# EAGLE design Buck_eFuse (EAGLE 9.5.1)
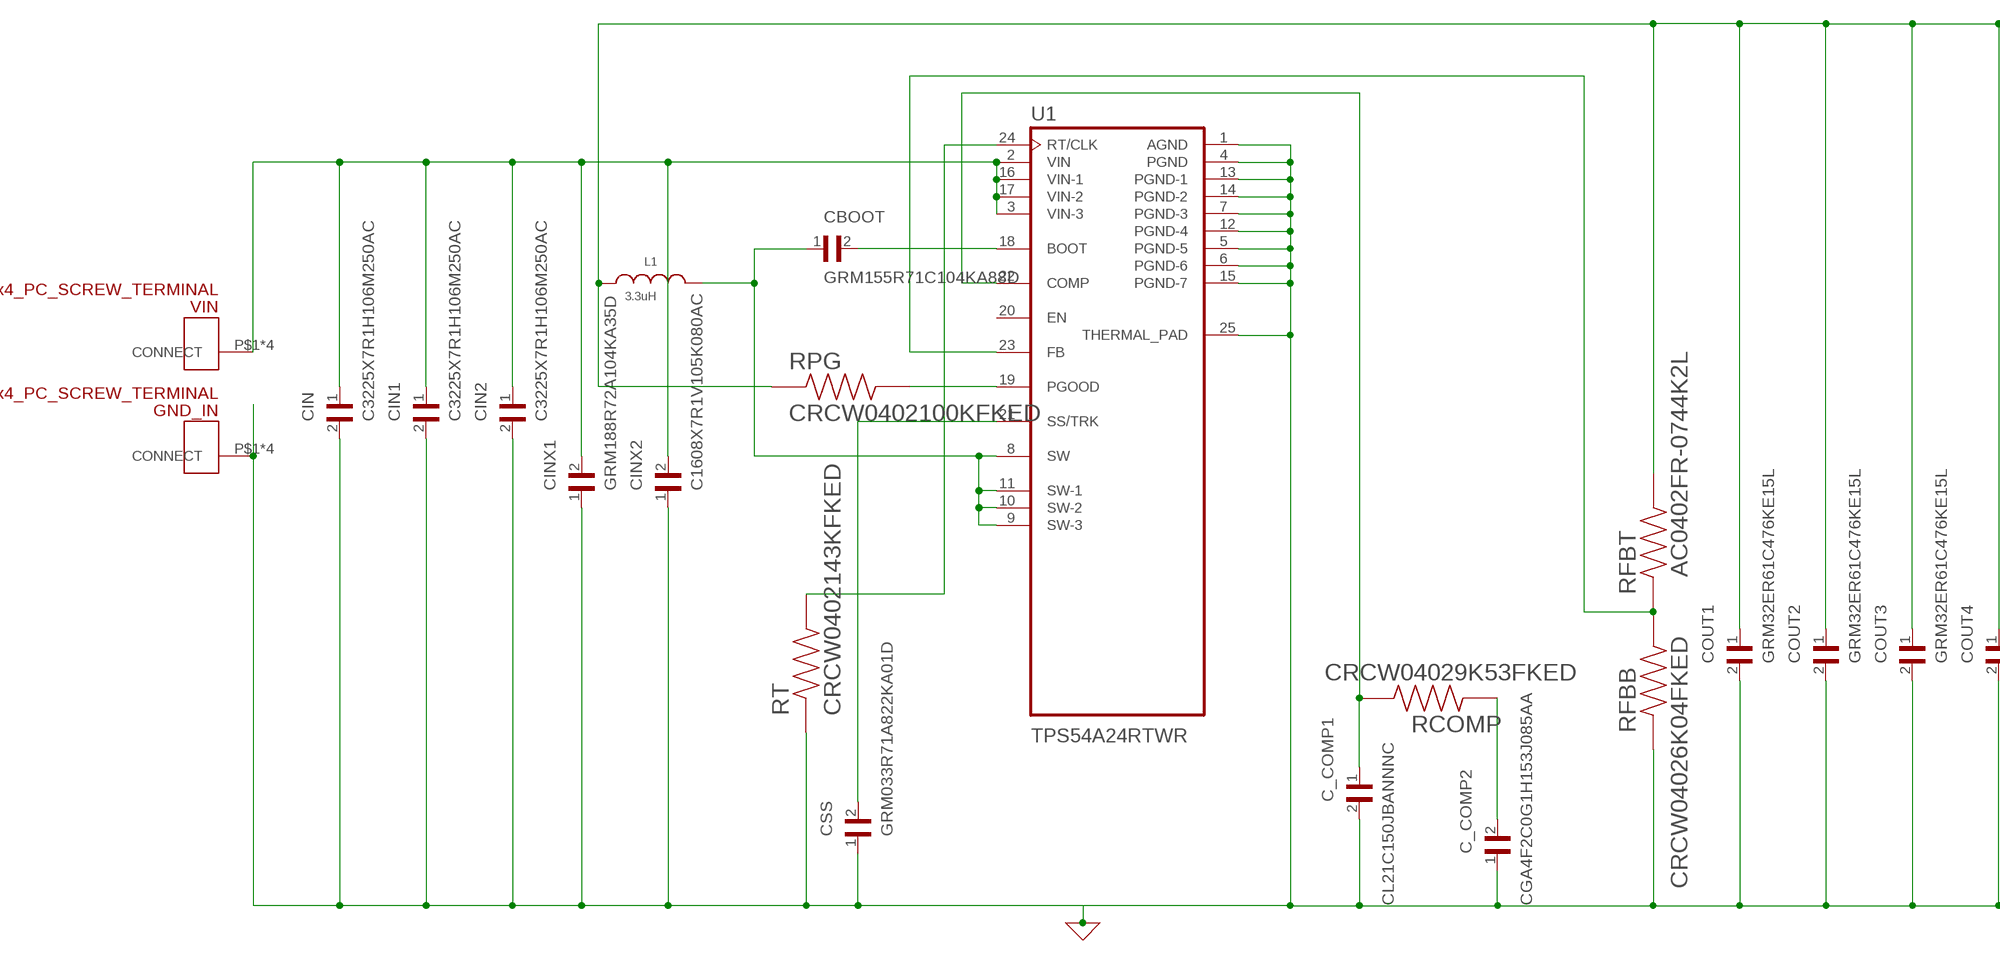
[diagram p0: schematic, sheet 1, part 1 of 2]
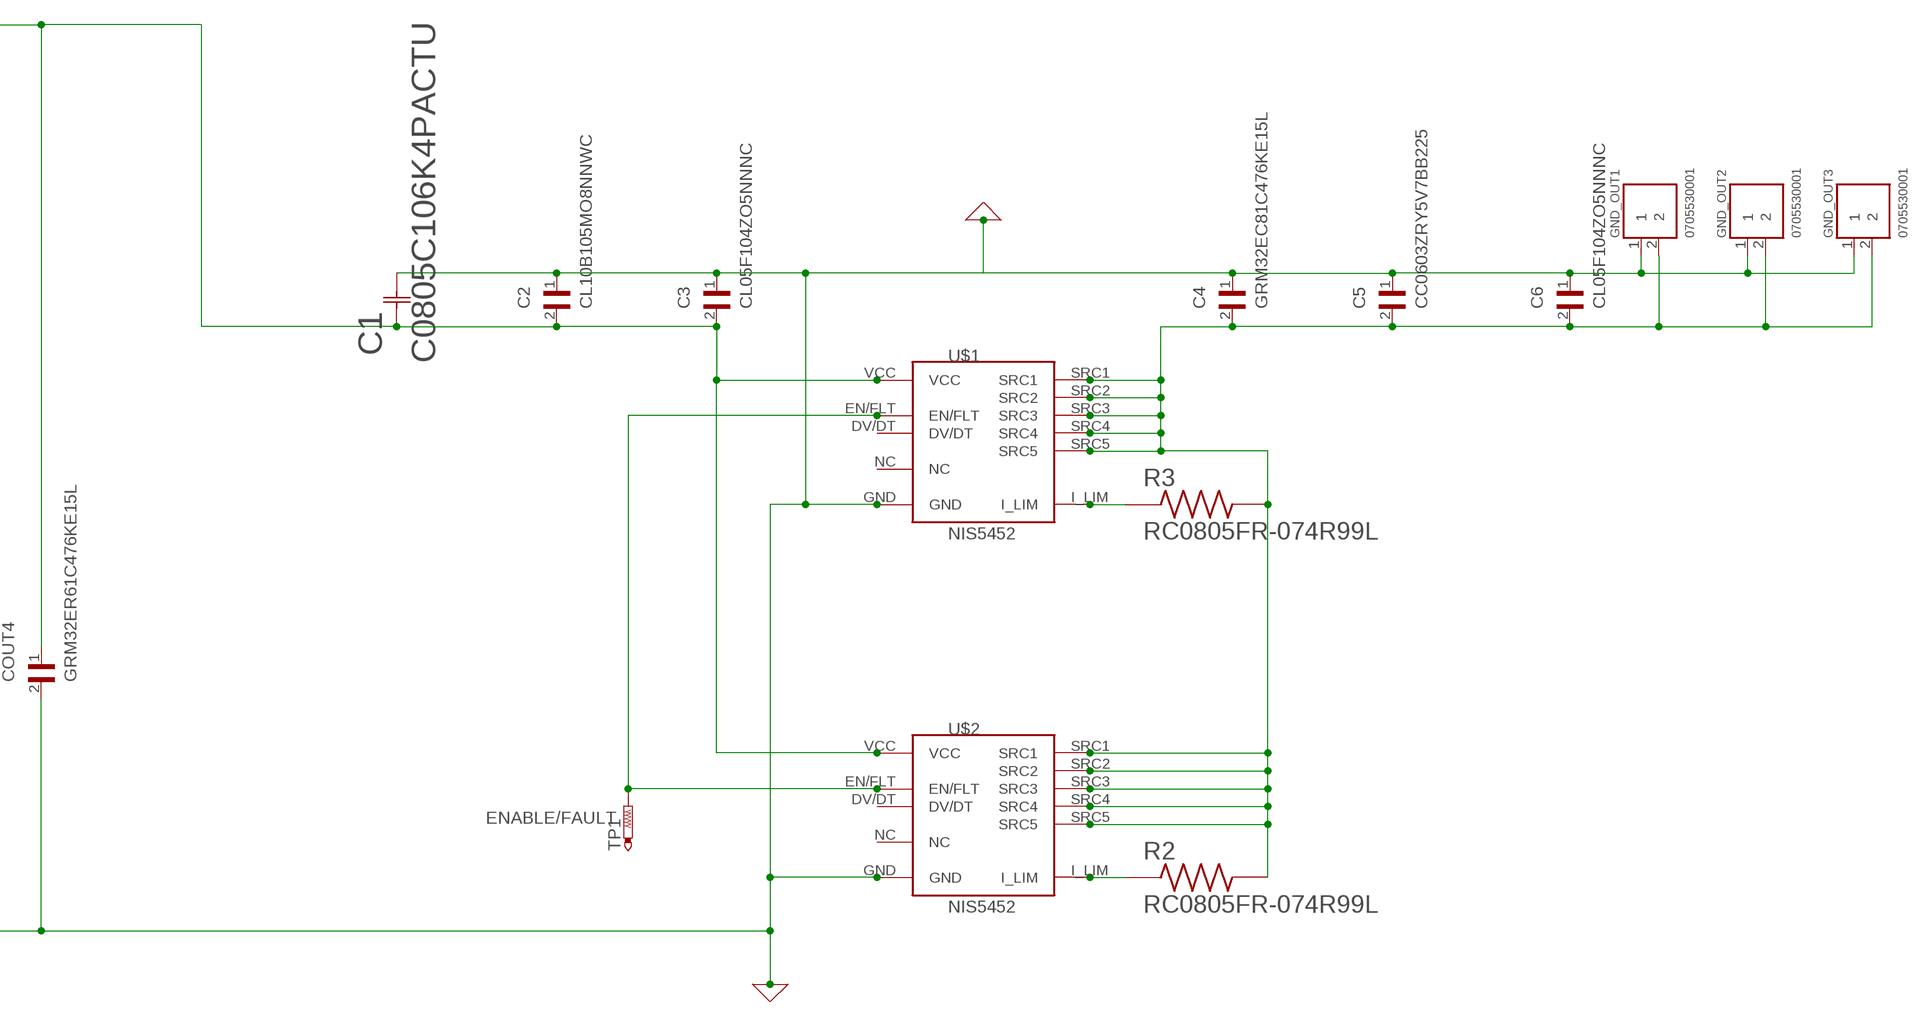
[diagram p1: schematic, sheet 1, part 2 of 2]

## Parts
C1  C0805C106K4PACTU  [CAP_C0805]
C2  CL10B105MO8NNWC  [CAPC1608X90N]
C3  CL05F104ZO5NNNC  [CAPC1005X55N]
C4  GRM32EC81C476KE15L  [CAPC3225X270N]
C5  CC0603ZRY5V7BB225  [CAPC1608X90]
C6  CL05F104ZO5NNNC  [CAPC1005X55N]
C_COMP1  CL21C150JBANNNC  [CAPC2012X140N]
C_COMP2  CGA4F2C0G1H153J085AA  [CAPC2012X100N]
CBOOT  GRM155R71C104KA88D  [CAPC1005X55N]
CIN  C3225X7R1H106M250AC  [CAPC3225X280N]
CIN1  C3225X7R1H106M250AC  [CAPC3225X280N]
CIN2  C3225X7R1H106M250AC  [CAPC3225X280N]
CINX1  GRM188R72A104KA35D  [CAPC1608X90N]
CINX2  C1608X7R1V105K080AC  [CAPC1608X90N]
COUT1  GRM32ER61C476KE15L  [CAPC3225X270N]
COUT2  GRM32ER61C476KE15L  [CAPC3225X270N]
COUT3  GRM32ER61C476KE15L  [CAPC3225X270N]
COUT4  GRM32ER61C476KE15L  [CAPC3225X270N]
CSS  GRM033R71A822KA01D  [CAPC0603X33N]
GND_IN  2X2_PC_SCREW_TERMINAL  [SCREW_TERMINAL]
GND_OUT1  0705530001  [MOLEX_0705530001]
GND_OUT2  0705530001  [MOLEX_0705530001]
GND_OUT3  0705530001  [MOLEX_0705530001]
L1  3.3uH  WE-HCC_1090_7443330330  [WE-HCC_1090]
R2  RC0805FR-074R99L  [RESC2012X60N]
R3  RC0805FR-074R99L  [RESC2012X60N]
RCOMP  CRCW04029K53FKED  [RESC1005X40N]
RFBB  CRCW04026K04FKED  [RESC1005X40N]
RFBT  AC0402FR-0744K2L  [RESC1005X37N]
RPG  CRCW0402100KFKED  [RESC1005X40N]
RT  CRCW0402143KFKED  [RESC1005X40N]
TP1  PTR1B2,54  [B2,54]
U1  TPS54A24RTWR  [VQFN50P400X400X100-24N]
U$1  NIS5452  [WDFN10]
U$2  NIS5452  [WDFN10]
VIN  2X2_PC_SCREW_TERMINAL  [SCREW_TERMINAL]

## Nets
0: C1.2 C2.1 C3.1 C4.1 C5.1 C6.1 C_COMP1.2 C_COMP2.1 CIN1.2 CIN2.2 CIN.2 CINX1.1 CINX2.1 COUT1.2 COUT2.2 COUT3.2 COUT4.2 CSS.1 GND_IN.P$1(CONNECT) GND_IN.P$2(CONNECT) GND_IN.P$3(CONNECT) GND_IN.P$4(CONNECT) GND_OUT1.1 GND_OUT2.1 GND_OUT3.1 RFBB.1 RT.1 U1.1(AGND) U1.4(PGND) U1.5(PGND-5) U1.6(PGND-6) U1.7(PGND-3) U1.12(PGND-4) U1.13(PGND-1) U1.14(PGND-2) U1.15(PGND-7) U1.25(THERMAL_PAD) U$1.GND U$2.GND ; supply symbol labelled GND
ENABLE/FAULT: TP1.TP U$1.EN/FLT U$2.EN/FLT
N$1 [Ground]: CBOOT.2 U1.18(BOOT)
N$2: CBOOT.1 L1.2 U1.8(SW) U1.9(SW-3) U1.10(SW-2) U1.11(SW-1)
N$3: R3.1 U$1.I_LIM
N$4: R2.1 U$2.I_LIM
N$5 [Ground]: CSS.2 U1.21(SS/TRK)
N$6 [Ground]: RT.2 U1.24(RT/CLK)
N$7 [Ground]: RPG.2 U1.19(PGOOD)
N$8 [Ground]: RFBB.2 RFBT.1 U1.23(FB)
N$9 [Ground]: C_COMP1.1 RCOMP.1 U1.22(COMP)
N$10 [Ground]: C_COMP2.2 RCOMP.2
N$12: CIN1.1 CIN2.1 CIN.1 CINX1.2 CINX2.2 U1.2(VIN) U1.3(VIN-3) U1.16(VIN-1) U1.17(VIN-2) VIN.P$1(CONNECT) VIN.P$2(CONNECT) VIN.P$3(CONNECT) VIN.P$4(CONNECT)
N$14: C1.1 C2.2 C3.2 COUT1.1 COUT2.1 COUT3.1 COUT4.1 L1.1 RFBT.2 RPG.1 U$1.VCC U$2.VCC
V_OUT: C4.2 C5.2 C6.2 GND_OUT1.2 GND_OUT2.2 GND_OUT3.2 R2.2 R3.2 U$1.SRC1 U$1.SRC2 U$1.SRC3 U$1.SRC4 U$1.SRC5 U$2.SRC1 U$2.SRC2 U$2.SRC3 U$2.SRC4 U$2.SRC5
Unconnected: U1.20(EN) U$1.DV/DT U$1.NC U$2.DV/DT U$2.NC

## Library data of the parts
C1 = qset_lib:C0805C106K4PACTU; MANUFACTURER_PART_NUMBER: C0805C106K4PACTU; VENDOR: Kemet
C2 = CL10B105MO8NNWC:CL10B105MO8NNWC: CL10 Series 0603 16 V 1 uF ±20% Tolerance X7R Multilayer Ceramic Capacitor; DESCRIPTION: CL10B105MO8NNWC; DIGI-KEY_PART_NUMBER: 1276-6524-1-ND; DIGI-KEY_PURCHASE_URL: https://www.digikey.ca/product-detail/en/samsung-electro-mechanics/CL10B105MO8NNWC/1276-6524-1-ND/5961383?utm_source=snapeda&utm_medium=aggregator&utm_campaign=symbol; MF: Samsung Electro-Mechanics; MP: CL10B105MO8NNWC; PACKAGE: 0603 Samsung
C3 C6 = CL05F104ZO5NNNC:CL05F104ZO5NNNC: CAP CER 0.1UF 16V Y5V 0402; DESCRIPTION: CL05 Series 0.1 uF 16 V -20/+80% Tolerance Y5V SMT Multilayer Ceramic Capacitor; DIGI-KEY_PART_NUMBER: 1276-1004-1-ND; DIGI-KEY_PURCHASE_URL: https://www.digikey.ca/product-detail/en/samsung-electro-mechanics/CL05F104ZO5NNNC/1276-1004-1-ND/3889090?utm_source=snapeda&utm_medium=aggregator&utm_campaign=symbol; MF: Samsung Electro-Mechanics; MP: CL05F104ZO5NNNC; PACKAGE: 0402 Samsung
C4 = GRM32EC81C476KE15L:GRM32EC81C476KE15L: CAPACITOR, 1210, X6S, 16V, 47UF; Capacitance:47µF; Capacitance Tolerance:± 10%; Voltage Rating:16V; Capacitor Case Style:1210; Operating Temperature Range:-55°C to +105°C; SVHC:No SVHC (19-Dec-2011); Capacitor Mounting:SMD; DESCRIPTION: Cap Ceramic 47uF 16V X6S 10% SMD 1210 105°C Embossed Plastic T/R; DIGI-KEY_PART_NUMBER: 490-10531-1-ND; DIGI-KEY_PURCHASE_URL: https://www.digikey.ca/product-detail/en/murata-electronics/GRM32EC81C476KE15L/490-10531-1-ND/5026469?utm_source=snapeda&utm_medium=aggregator&utm_campaign=symbol; MF: Murata Electronics; MP: GRM32EC81C476KE15L; PACKAGE: 1210 Murata
C5 = CC0603ZRY5V7BB225:CC0603ZRY5V7BB225: Multilayer chip capacitors; DESCRIPTION: Multilayer Ceramic Capacitor, CC Series, 2.2 - F, +80%, -20%, Y5V, 16 V, 0603 [1608 Metric]; DIGI-KEY_PART_NUMBER: 311-3416-1-ND; DIGI-KEY_PURCHASE_URL: https://www.digikey.ca/product-detail/en/yageo/CC0603ZRY5V7BB225/311-3416-1-ND/7164437?utm_source=snapeda&utm_medium=aggregator&utm_campaign=symbol; MF: Yageo; MP: CC0603ZRY5V7BB225; PACKAGE: 0603 Yageo
C_COMP1 = CL21C150JBANNNC:CL21C150JBANNNC: Cap Ceramic 15pF 50V C0G 5% Pad SMD 0805 125C T/R; AVAILABILITY: Unavailable; DESCRIPTION: Cap Ceramic 15pF 50V C0G 5% Pad SMD 0805 125°C T/R; MF: Samsung; MP: CL21C150JBANNNC; PACKAGE: 0805 Samsung; PRICE: None
C_COMP2 = CGA4F2C0G1H153J085AA:CGA4F2C0G1H153J085AA: SMD Multilayer Ceramic Capacitor, CGA Series, 0.015 F, 5%, C0G / NP0, 50 V, 0805 [2012 Metric]; AVAILABILITY: Unavailable; DESCRIPTION: SMD Multilayer Ceramic Capacitor, CGA Series, 0.015 F, 5%, C0G / NP0, 50 V, 0805 [2012 Metric]; MF: TDK; MP: CGA4F2C0G1H153J085AA; PACKAGE: 2012 TDK; PRICE: None
CBOOT = GRM155R71C104KA88D:GRM155R71C104KA88D: CAP CER 0.1UF 16V 10% X7R 0402; AVAILABILITY: Unavailable; DESCRIPTION: 0402 0.1 uF 16 V ±10% Tolerance X7R SMT Multilayer Ceramic Capacitor; MF: Murata; MP: GRM155R71C104KA88D; PACKAGE: 1005 Taiyo Yuden; PRICE: None
CIN CIN1 CIN2 = C3225X7R1H106M250AC:C3225X7R1H106M250AC: CAP CER 10UF 50V X7R 1210; DESCRIPTION: C Series 1210 10 uF 50 V ±20 % Tolerance X7R SMT Multilayer Ceramic Capacitor; DIGI-KEY_PART_NUMBER: 445-14933-1-ND; DIGI-KEY_PURCHASE_URL: https://www.digikey.com/product-detail/en/tdk-corporation/C3225X7R1H106M250AC/445-14933-1-ND/3956599?utm_source=snapeda&utm_medium=aggregator&utm_campaign=symbol; MF: TDK; MP: C3225X7R1H106M250AC; PACKAGE: 1210 TDK
CINX1 = GRM188R72A104KA35D:GRM188R72A104KA35D: CAPACITOR, 0603, X7R, 100V, 100NF; Dielectric Characteristic:X7R; Capacitance:0.1µF; Capacitance Tolerance:± 10%; Voltage Rating:100V; Temperature Coefficient:± 15%; Capacitor Case Style:0603; No. of Pins:2; Capacitor Mounting:SMD; Operating Temperature Range:-55°C to +125°C; SVHC:No SVHC (18-Jun-2010); Mounting Type:SMD; Reel Quantity:4000; AVAILABILITY: Unavailable; DESCRIPTION: 0603 0.1 uF 100 V ±10% Tolerance X7R SMT Multilayer Ceramic Capacitor; MF: Murata Electronics; MP: GRM188R72A104KA35D; PACKAGE: 1608 Murata; PRICE: None
CINX2 = C1608X7R1V105K080AC:C1608X7R1V105K080AC: CAP, MLCC, 1UF, 35V, X7R, 0603; Product Range:TDK - C Series; Capacitance:1µF; Capacitance Tolerance:± 10%; Dielectric Characteristic:X7R; Voltage Rating:35V; Capacitor Case Style:0603 [1608 Metric]; Operating Temperature Min:-55°C; Operating Temperature Max:125°C; Packaging:Cut Tape; MSL:-; SVHC:No SVHC (20-Jun-2013); AVAILABILITY: Unavailable; DESCRIPTION: Cap Ceramic 1uF 35V X7R 10% SMD 0603 125C T/R; MF: TDK; MP: C1608X7R1V105K080AC; PACKAGE: 1608 TDK; PRICE: None
COUT1-COUT4 = GRM32ER61C476KE15L:GRM32ER61C476KE15L: Cap Ceramic 47uF 16V X5R 10% SMD 1210 85°C Embossed T/R; AVAILABILITY: Unavailable; DESCRIPTION: 1210 47 uF 16 V ±10% Tolerance X5R SMT Multilayer Ceramic Capacitor; MF: Murata Electronics; MP: GRM32ER61C476KE15L; PACKAGE: 1210 Murata; PRICE: None
CSS = GRM033R71A822KA01D:GRM033R71A822KA01D: CAP CER 8200PF 10V X7R 0201; AVAILABILITY: Unavailable; DESCRIPTION: Cap Ceramic 0.0082uF 10V X7R 10% SMD 0201 125°C Paper T/R; MF: Murata Electronics; MP: GRM033R71A822KA01D; PACKAGE: 0603 Taiyo Yuden; PRICE: None
GND_IN VIN = AustinCustomLib:2X2_PC_SCREW_TERMINAL
GND_OUT1-GND_OUT3 = 0705530001:0705530001: Conn Shrouded Header HDR 2 POS 2.54mm Solder RA Thru-Hole SLÃ¢âÂ¢ Tube; DESCRIPTION: Conn Shrouded Header HDR 2 POS 2.54mm Solder RA Thru-Hole SLÃ¢â¢ Tube; DIGI-KEY_PART_NUMBER: WM4900-ND; DIGI-KEY_PURCHASE_URL: https://www.digikey.com/product-detail/en/molex/0705530001/WM4900-ND/114951?utm_source=snapeda&utm_medium=aggregator&utm_campaign=symbol; MF: Molex; MP: 0705530001; PACKAGE: None
L1 = Eagle_WE-HCC (rev19a):WE-HCC_1090: WE-HCC SMD High Current Cube Inductor Characteristics Magnetically shielded Operating temperature: –40 °C to +125 °C Recommended solder profile: Reflow Current capability up to 27 A Excellent saturation characteristics Applications Filter choke for DC/DC converter Single and polyphase buck converter Filter choke for motor electronics Input filter inductor for DC/DC converter <https://katalog.we-online.com/media/images/v2/o14794v209%20Family_WE-HCC.jpg> Details see: https://katalog.we-online.com/en/pbs/WE-HCC?m Updated by Yingchun,Shan 2019-08-07 2019 (C) Wurth Elektronik; DATASHEET-URL: https://katalog.we-online.com/pbs/datasheet/7443330330.pdf; FRES: 51MHz; IR: 14A; ISAT: 15.5A; MATERIAL: Ferrite; PART-NUMBER: 7443330330; RDC-MAX: 7.15mOhm; RDC-TYP: 6.5mOhm
R2 R3 = RC0805FR-074R99L:RC0805FR-074R99L: Resistor: thick film; SMD; 0805; 4.99Ω; 0.125W; ±1%; -55÷155°C; DESCRIPTION: RC Series 0805 0.125 W 4.99 Ohms 1% ±200 ppm/°C SMT Thick Film Chip Resistor; DIGI-KEY_PART_NUMBER: 311-4.99CRCT-ND; DIGI-KEY_PURCHASE_URL: https://www.digikey.ca/product-detail/en/yageo/RC0805FR-074R99L/311-4.99CRCT-ND/730884?utm_source=snapeda&utm_medium=aggregator&utm_campaign=symbol; MF: Yageo; MP: RC0805FR-074R99L; PACKAGE: 2012 Rohm Semiconductor
RCOMP = CRCW04029K53FKED:CRCW04029K53FKED: Resistor;Thick Film;9.53 Kilohms;0.063 W;1%;SMT;0402;TCR 37 ppm/DegC;Cut Tape; AVAILABILITY: Unavailable; DESCRIPTION: CRCW Series 0402 0.063 W 9.53 kOhm ±1 % ±100 ppm/K SMT Thick Film Chip Resistor; MF: Vishay; MP: CRCW04029K53FKED; PACKAGE: 1005 Panasonic Electronic Components; PRICE: None
RFBB = CRCW04026K04FKED:CRCW04026K04FKED: Resistor;Thick Film;6.04 Kilohms;0.063 W;1%;SMT;0402;TCR 37 ppm/DegC; AVAILABILITY: Unavailable; DESCRIPTION: Res Thick Film 0402 6.04K Ohm 1% 0.063W_1/16W_ ±100ppm/C Molded SMD Automotive Paper T/R; MF: Vishay Dale; MP: CRCW04026K04FKED; PACKAGE: 1005 Panasonic Electronic Components; PRICE: None
RFBT = AC0402FR-0744K2L:AC0402FR-0744K2L: AC0402 44,2K 1% 0,063W AUTOMO; AVAILABILITY: Unavailable; DESCRIPTION: Res Thick Film 0402 44.2K Ohm 1% 0.063W_1/16W_ ±100ppm/C Epoxy Pad SMD Automotive T/R; MF: Yageo; MP: AC0402FR-0744K2L; PACKAGE: 1005 Yageo; PRICE: None
RPG = CRCW0402100KFKED:CRCW0402100KFKED: RES, THICK FILM, 100K, 1%, 0.063W, 0402; AVAILABILITY: Unavailable; DESCRIPTION: Res Thick Film 0402 100K Ohm 1% 0.063W_1/16W_ ±100ppm/C Molded SMD Automotive Paper T/R; MF: Vishay; MP: CRCW0402100KFKED; PACKAGE: 1005 Panasonic Electronic Components; PRICE: None
RT = CRCW0402143KFKED:CRCW0402143KFKED: D10/Crcw0402 100 143K 1% Et7 E3; AVAILABILITY: Unavailable; DESCRIPTION: CRCW Series 0402 0.063 W 143 kOhm ±1 % ±100 ppm/K SMT Thick Film Chip Resistor; MF: Vishay; MP: CRCW0402143KFKED; PACKAGE: 1005 Panasonic Electronic Components; PRICE: None
TP1 = testpad:PTR1: TEST PIN
U1 = TPS54A24RTWR:TPS54A24RTWR: None; AVAILABILITY: Unavailable; DESCRIPTION: BSR-CCP; MF: Texas Instruments; MP: TPS54A24RTWR; PACKAGE: WQFN-24 Texas Instruments; PRICE: None
U$1 U$2 = qset_lib:NIS5452

## Board
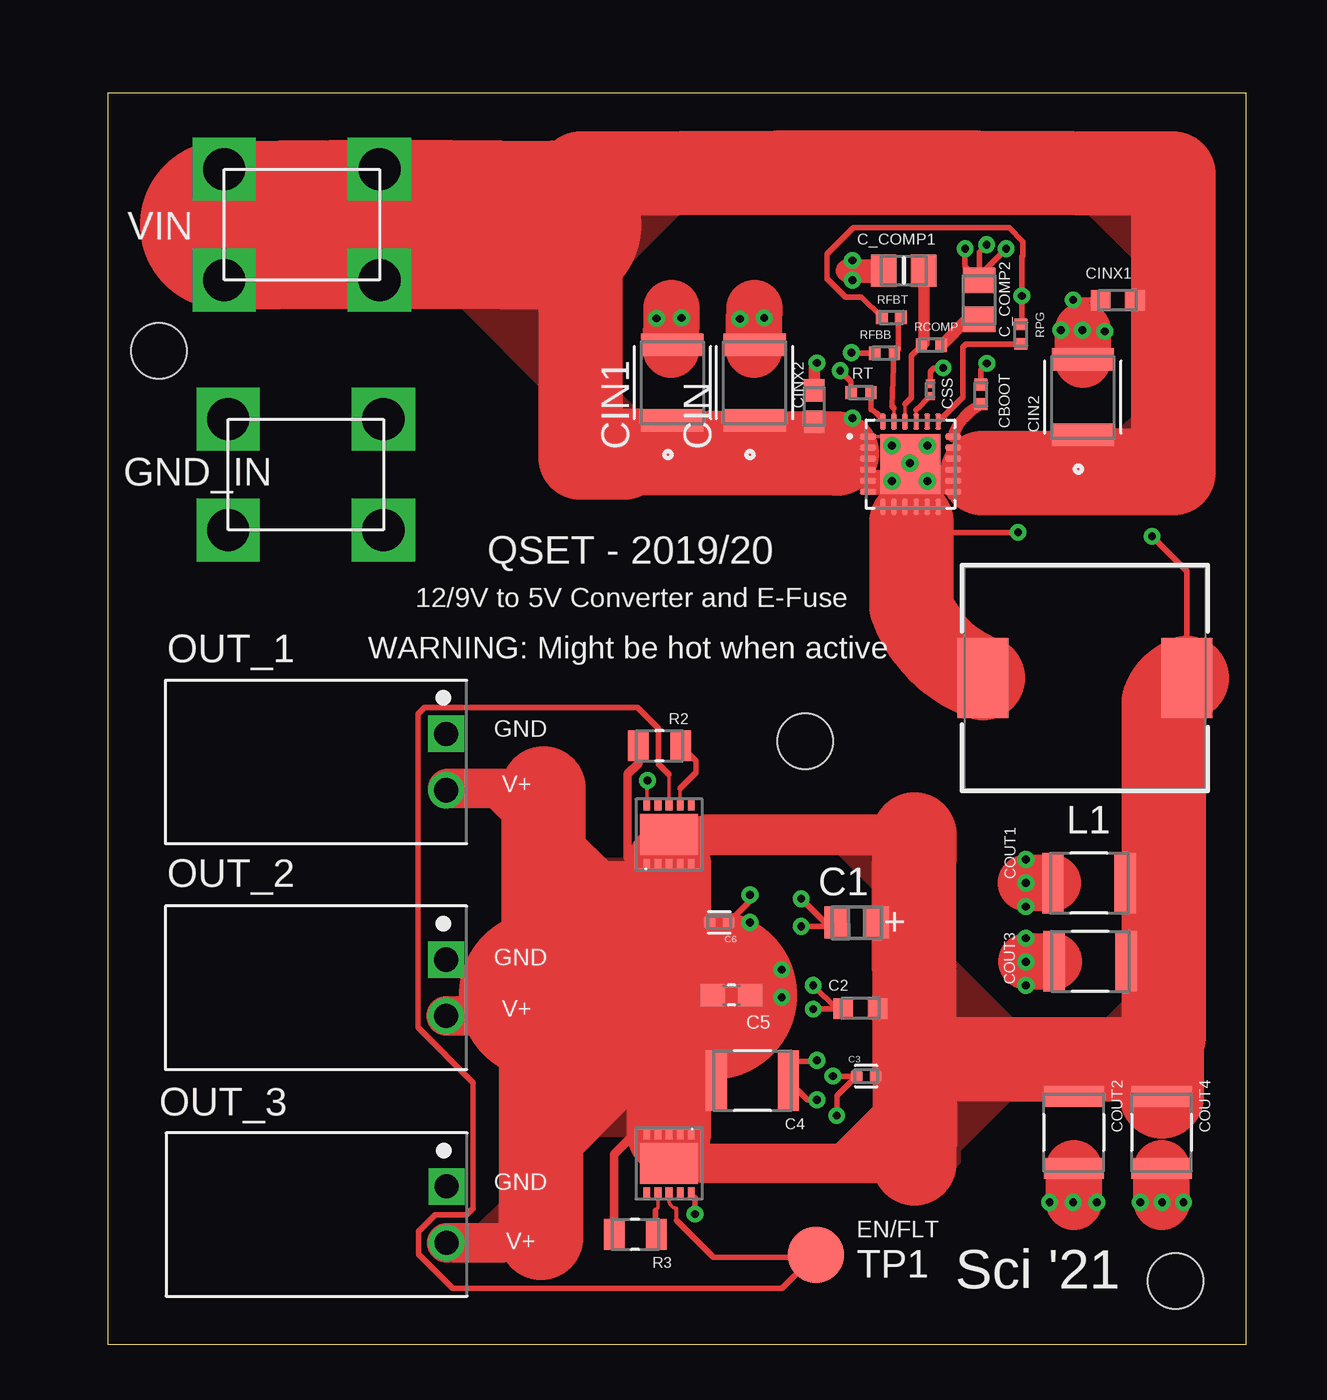
[diagram p2: board, top side]
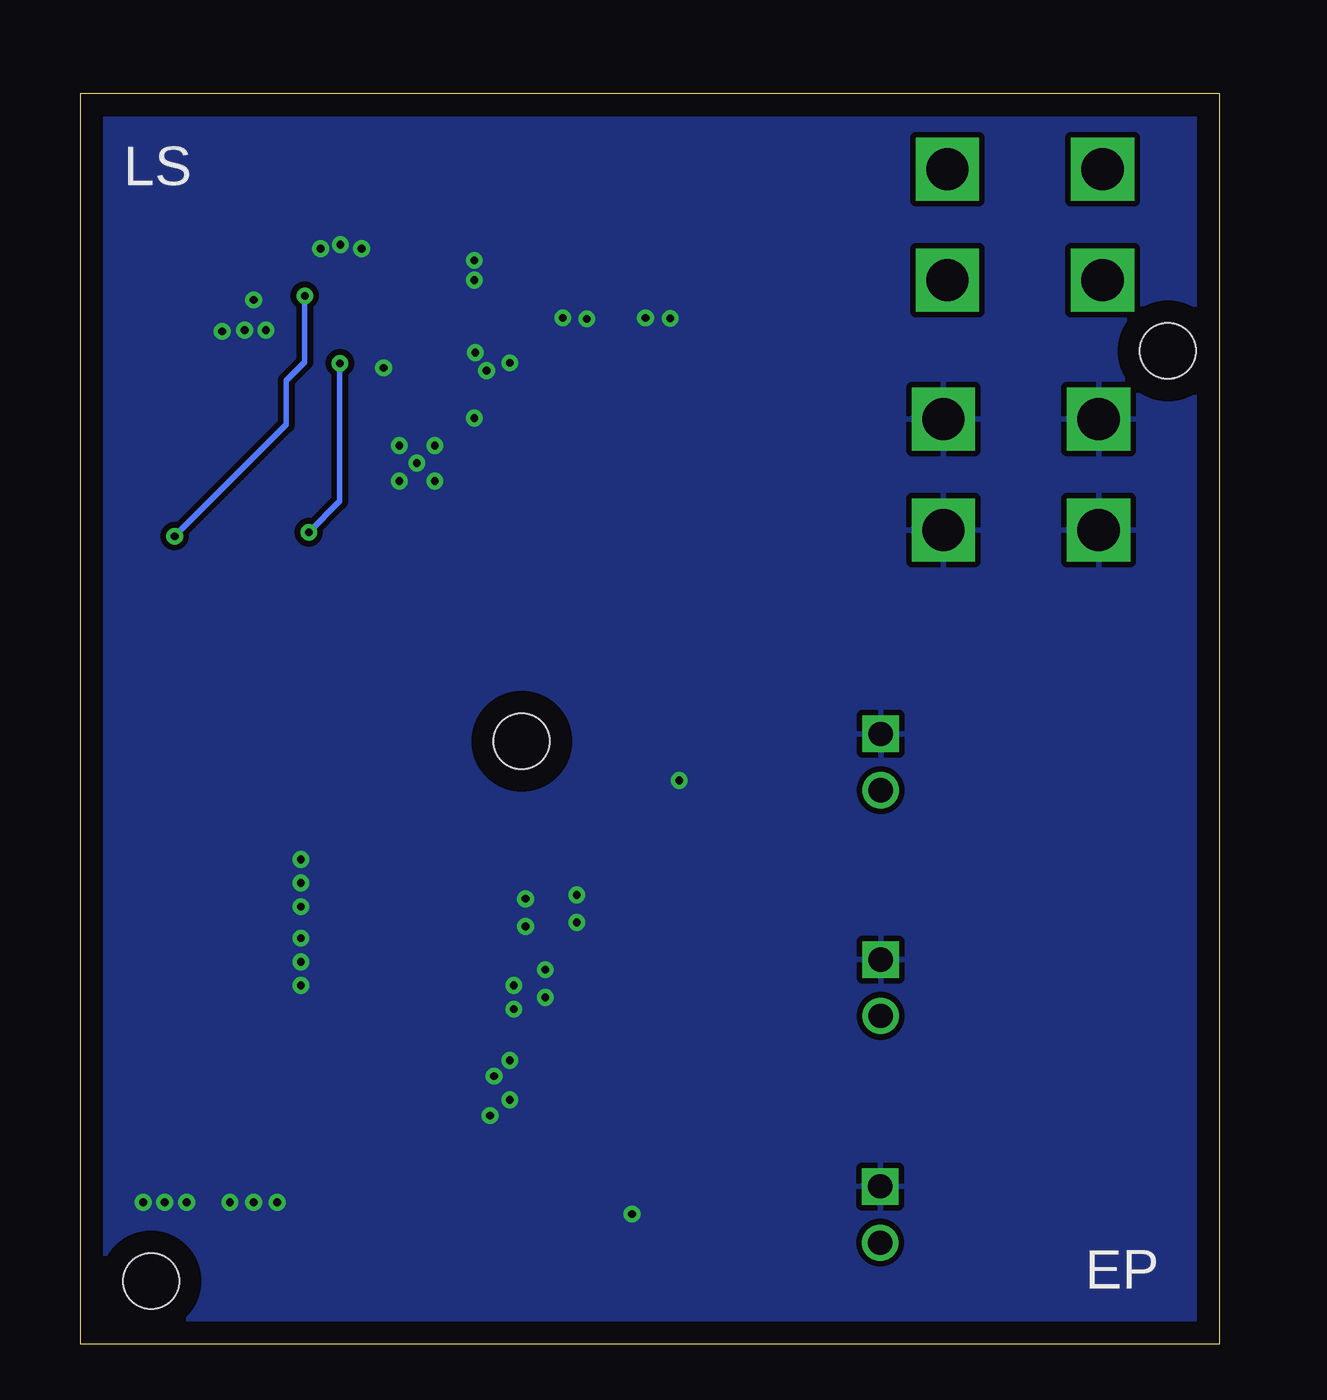
[diagram p3: board, bottom side, seen from below]

Size 51.36 x 56.44 mm. Coordinates in mm from the lower left corner, seen from the top.
Outline: 0,0 51.36,0 51.36,56.44 0,56.44 0,0
Copper layers (1*16): Top 0.035mm / dielectric 1.5mm / Bottom 0.035mm
Design rules "default *": minimum track width 6mil, minimum drill 0.35mm, track to track 10mil, track to pad 10mil, pad to pad 6mil, via to via 10mil, smd to smd 10mil, copper to edge 40mil, drill to drill 6mil, minimum pad ring 10mil, minimum via ring 8mil, stop-mask expansion 4mil, vias tented up to drill 0mil, thermal gap 10mil
Holes 2.5 mm at 2.31,44.81 31.47,27.2 48.18,2.84

### Footprints (pad centres in the part's own frame; a part is rotated, then mirrored left to right if it is on the bottom)
CAP_C0805 = smd 1.112 x 1.448: 1 -0.899,0; 2 0.899,0
CAPC1608X90N = smd 0.87 x 0.93: 1 -0.78,0; 2 0.78,0
CAPC1005X55N = smd 0.54 x 0.6: 1 -0.43,0; 2 0.43,0
CAPC3225X270N = smd 0.96 x 2.72: 1 -1.625,0; 2 1.625,0
CAPC1608X90 = smd 1.1 x 1: 1 -0.85,0; 2 0.85,0
CAPC2012X140N = smd 1.15 x 1.45: 1 -0.9,0; 2 0.9,0
CAPC2012X100N = smd 1.15 x 1.47: 1 -0.88,0; 2 0.88,0
CAPC1005X55N' = smd 0.54 x 0.6: 1 -0.432,0; 2 0.432,0
CAPC3225X280N = smd 1.01 x 2.81: 1 -1.7,0; 2 1.7,0
CAPC1608X90N' = smd 0.89 x 0.93: 1 -0.77,0; 2 0.77,0
CAPC1608X90N'' = smd 1.01 x 0.93: 1 -0.709,0; 2 0.709,0
CAPC0603X33N = smd 0.38 x 0.4: 1 -0.281,0; 2 0.281,0
SCREW_TERMINAL = drill 1.9 pad 2.3 square: P$1 0,0; P$2 0,7; P$3 5,7; P$4 5,0
MOLEX_0705530001 = drill 1.09 square: 1 0,0 | drill 1.09: 2 2.54,0
WE-HCC_1090 = smd 2.3 x 3.6: 1 -4.6,0; 2 4.6,0
RESC2012X60N = smd 0.92 x 1.38: 1 -0.955,0; 2 0.955,0
RESC1005X40N = smd 0.51 x 0.6: 1 -0.445,0; 2 0.445,0
RESC1005X37N = smd 0.54 x 0.6: 1 -0.432,0; 2 0.432,0
B2,54 = smd 2.54 x 2.54: TP 0,0
VQFN50P400X400X100-24N = smd 0.74 x 0.26: 1 -1.92,1.25; 2 -1.92,0.75; 3 -1.92,0.25; 4 -1.92,-0.25; 5 -1.92,-0.75; 6 -1.92,-1.25; 13 1.92,-1.25; 14 1.92,-0.75; 15 1.92,-0.25; 16 1.92,0.25; 17 1.92,0.75; 18 1.92,1.25 | smd 0.26 x 0.74: 7 -1.25,-1.92; 8 -0.75,-1.92; 9 -0.25,-1.92; 10 0.25,-1.92; 11 0.75,-1.92; 12 1.25,-1.92; 19 1.25,1.92; 20 0.75,1.92; 21 0.25,1.92; 22 -0.25,1.92; 23 -0.75,1.92; 24 -1.25,1.92 | smd 2.7 x 2.7: 25 0,0
WDFN10 = smd 0.301 x 0.565: DV/DT -0.5,1.37; EN/FLT 0,1.37; GND -1,1.37; I_LIM 0.5,1.37; NC 1,1.37; SRC1 -1,-1.37; SRC2 -0.5,-1.37; SRC3 0,-1.37; SRC4 0.5,-1.37; SRC5 1,-1.37 | smd 2.602 x 1.851: VCC 0,0

### Placement (x,y rotation side)
C1  33.78,19.02 180 top
C2  33.96,15.14 0 top
C3  34.21,12.09 0 top
C4  29.08,11.89 180 top
C5  28.14,15.75 180 top
C6  27.58,19.02 180 top
C_COMP1  35.92,48.44 180 top
C_COMP2  39.32,47.12 270 top
CBOOT  GRM155R71C104KA88D  [CAPC1005X55N']  39.4,42.85 270 top
CIN  29.18,43.38 90 top
CIN1  25.48,43.38 90 top
CIN2  43.99,42.72 90 top
CINX1  GRM188R72A104KA35D  [CAPC1608X90N']  45.57,47.09 0 top
CINX2  C1608X7R1V105K080AC  [CAPC1608X90N'']  31.88,42.32 270 top
COUT1  44.27,20.8 180 top
COUT2  43.59,9.55 270 top
COUT3  44.32,17.27 180 top
COUT4  47.55,9.55 270 top
CSS  37.11,43.05 270 top
GND_IN  5.44,41.73 270 top
GND_OUT1  15.29,7.11 270 top
GND_OUT2  15.27,17.35 270 top
GND_OUT3  15.27,27.53 270 top
L1  44.09,30.05 180 top
R2  24.89,27 180 top
R3  23.8,4.95 180 top
RCOMP  37.16,45.06 0 top
RFBB  35.05,44.7 0 top
RFBT  35.36,46.33 180 top
RPG  41.2,45.57 270 top
RT  33.99,42.93 0 top
TP1  31.95,4.04 270 top
U1  36.22,39.7 0 top
U$1  25.32,8.15 180 top
U$2  25.32,22.99 0 top
VIN  5.26,53.01 270 top

### Tracks (layer width: path | path; a pad name or v marks a point on that pad's centre or on a via)
0  (via drill 0.35)
  Top 0.152: U1.7 34.97,38.31 | 34.66,40.95 arc20 U1.1 34.97,40.95 | 37.47,38.45 arc1 U1.12 37.47,38.31 37.61,38.45 arc-90 U1.13 | U$2.GND 24.32,25.39 | U$1.GND 26.49,6.62 | 30.3,15.75 v30.4,15.65 | C2.1 33.15,15.11 | C1.2 32.7,18.85 | 25.65,45.39 25.48,45.21 CIN1.2 25.48,44.93 25.42,44.87 | 35.12,39.33 34.99,39.33 | 35.71,39.33 35.36,39.33 | 35.35,39.33 35.12,39.33 | 35.12,39.33 | 35.85,39.33 35.71,39.33 | 35.23,39.2 35.36,39.33 | 34.76,38.95 35.47,38.95 | 35.36,39.33 | 35.36,39.33 35.19,39.15 | 35.36,39.33 35.35,39.33 | 35.35,39.33 34.82,38.79 35.31,38.79 35.85,39.33 | U1.25 35.85,39.33 | 34.85,38.45 34.85,38.47 35.71,39.33
  Top 0.254: U1.15 arc-1 U1.14 U1.13 37.47,38.45 | 34.97,38.31 34.66,38.63 34.48,38.63 arc90 U1.6 | U1.6 U1.5 | U1.5 arc1 U1.4 | 34.97,38.45 35.47,38.95 | v32.72,12.09 C3.1 32.89,11.2 v32.89,10.31 | 24.32,25.39 v24.36,25.43 | 26.49,6.62 v26.49,5.87 | v28.98,19.02 C6.1 28.98,19.99 v28.98,20.27 | 30.71,11.07 30.76,11.02 30.76,11.84 C4.1 31.57,11.02 v32,11.02 | 30.76,12.8 30.71,12.75 31.95,12.75 v32,12.8 | v33.05,43.92 33.54,43.42 RT.1 | v41.43,19.74 41.96,20.27 42.67,20.27 | COUT1.2 41.43,21.84 v41.43,21.87 | 43.99,45.72 v43.97,45.74 | 43.59,6.43 v43.56,6.4 | 47.55,6.43 v47.57,6.4 | RFBB.1 33.58,44.7 v33.55,44.73 | v33.6,48.9 34.06,48.44 C_COMP1.2 34.58,48.01 v33.6,48.01 | 24.89,46.15 v24.77,46.28 25.48,45.57 | v42.49,6.4 42.49,6.83 COUT2.2 43.59,7.44 v44.63,6.4 | v46.58,6.4 47.55,7.37 COUT4.2 47.55,7.39 v48.54,6.4 | 30.3,15.75 C5.1 30.14,16.89 v30.4,16.89 | 33.15,15.11 v31.83,15.11 | 32.7,18.85 v31.29,18.85 | C1.2 32.36,19.02 v31.29,20.09 | v31.83,16.18 32.87,15.14 C2.1 | v41.43,17.25 41.45,17.27 | C_COMP2.1 39.32,49.28 v39.65,49.61 | C_COMP2.1 39.32,48.21 v40.54,49.43 | C_COMP2.1 38.68,48.63 v38.68,49.43 | v28.52,46.25 29.57,46.25 v29.62,46.3 29.18,45.87 CIN.2 29.18,44.9 29.15,44.87 | CSS.1 arc1 37.11,43.87 37.29,44.04 v37.69,44.04 | 35.27,39.16 35.38,39.28 35.8,39.28 U1.25 36.98,40.46 v36.98,40.54 | 34.76,38.95 34.52,38.72 34.52,38.73 U1.5 | U1.6 34.85,38.45 34.9,38.45 | CINX1.1 43.59,47.09 v43.56,47.12 | 25.48,45.9 25.48,46.05 25.35,46.23 | 25.65,45.39 25.48,45.57 | 25.41,45.15 CIN1.2 | 25.48,45.57 25.48,45.9 | 25.48,45.9 v25.88,46.3
  Top 0.381: 37.47,38.45 v36.98,38.94
  Top 0.406: U1.1 arc40 33.6,41.65
  Top 0.508: v36.98,38.94 v36.97,38.95 | v33.6,41.78 33.6,41.65 | CINX2.1 31.88,44.15 v32,44.27
  Top 1.016: U1.5 arc1 35.47,38.95 | U1.14 arc1 v36.97,38.95 | C_COMP1.2 arc1 33.35,48.44
  Top 2.54: COUT1.2 arc1 v41.43,20.8 | CIN2.2 arc1 43.99,45.72 | COUT2.2 arc1 43.59,6.43 | COUT4.2 arc1 47.55,6.43 | 41.45,17.27 arc1 COUT3.2 | 29.15,44.87 arc-1 29.17,46.75 | 25.42,44.87 arc-1 25.44,46.75
  other vias: 41.43,16.18 41.43,18.31 43,45.75 44.98,45.69 36.2,39.75 35.38,40.54 35.38,38.94
  pour Bottom: 50.85,55.47 50.85,0.18 0.18,0.18 0.18,55.47
ENABLE/FAULT
  Top 0.152: U$1.EN/FLT 25.32,6.46 arc70 25.66,6.12 | U$2.EN/FLT 25.32,25.7
  Top 0.178: 25.66,5.59 25.66,6.12
  Top 0.254: 25.32,25.7 24.85,26.16 24.85,27.77 23.89,28.73 14.29,28.73 13.99,28.44 13.99,14.28 16.49,11.79 16.49,6.14 16.2,5.84 14.77,5.84 14.02,5.1 14.02,4.05 15.55,2.52 30.43,2.52 31.83,3.91 | 31.83,3.91 TP1.TP | 25.66,5.59 27.34,3.91 31.83,3.91
N$1
  Top 0.508: U1.18 arc-40 39.07,42.18 CBOOT.2
N$2  (via drill 0.35)
  Top 0.152: 36.65,37.6 36.97,37.6 arc50 U1.11
  Top 0.254: U1.8 arc1 35.65,37.6 35.79,37.6 U1.9 36.27,37.78 U1.10 arc1 36.65,37.6 | CBOOT.1 39.4,43.98 v39.67,44.25 | 36.27,37.08 36.27,36.98 36.63,36.63 v41.07,36.63
  Top 1.575: 36.27,37.78 arc1 36.27,36.98
  Top 3.81: 36.27,37.08 arc1 36.27,34.54 36.27,33.27 arc50 L1.2
  Bottom 0.254: v39.67,44.25 39.67,38.03 v41.07,36.63
N$3
  Top 0.152: U$1.I_LIM 24.82,6.16 24.71,6.04
  Top 0.254: 24.71,6.04 24.71,5.13 24.82,5.02
  Top 0.33: 24.82,5.02 R3.1
N$4
  Top 0.152: U$2.I_LIM 25.82,25.07
  Top 0.254: R2.1 26.54,26.31 26.54,25.78 25.82,25.07
N$5
  Top 0.152: 36.47,42.13 U1.21
  Top 0.254: CSS.2 arc1 36.47,42.13
N$6
  Top 0.254: U1.24 arc40 34.43,42.16 RT.2
N$7
  Top 0.254: U1.19 arc1 38.58,42.73 38.58,44.98 38.72,45.12 RPG.2
N$8
  Top 0.152: 35.47,42.23 U1.23
  Top 0.254: RFBT.1 35.67,46.22 35.67,44.88 RFBB.2 35.47,44.68 35.38,42.32 35.47,42.23
N$9
  Top 0.152: U1.22 35.97,42.41
  Top 0.254: 35.97,42.41 36.26,42.7 36.26,44.6 RCOMP.1
  Top 0.508: C_COMP1.1 36.82,45.16 RCOMP.1
N$10
  Top 0.508: C_COMP2.2 38.78,46.24 RCOMP.2
N$12
  Top 0.152: 23.29,40.01 23.47,40.18 | 48.08,41.96 47.37,41.25 44.22,41.25 CIN2.1 | 21.34,42.14 24,42.14 24.71,41.43 25.22,41.43 CIN1.1
  Top 0.254: U1.3 arc1 34.12,40.13 34.12,40.18 | 34.3,40.18 arc1 U1.2 | U1.16 arc1 38.14,40.18 arc1 U1.17 | CINX2.2 31.88,41.2 32.89,40.18 30.68,40.18 CIN.1 CIN1.1 | CIN2.1 43.15,40.18 39.65,40.18 39.47,40.01 39.47,39.29 | 21.34,49.43 20.54,50.23 | VIN.P$3 | VIN.P$3 18.32,48.01 20.54,50.23 | VIN.P$2 VIN.P$3 | VIN.P$4 5.26,50.49 VIN.P$1 17.75,53.01 20.27,50.49 20.54,50.23 | CINX1.2 46.34,51.06 48.08,52.81
  Top 0.508: 34.3,40.18 34.12,40.18
  Top 0.635: 34.12,40.18 arc1 32.89,40.18 | 38.14,40.18 arc1 39.65,40.18
  Top 3.81: 32.89,40.18 arc1 23.47,40.18 | 39.47,39.29 arc-1 45.52,39.29 arc-1 48.08,39.29 48.08,41.96 48.08,49.25 48.08,52.81 arc1 21.34,52.81 21.34,49.43 21.34,43.74 21.34,42.14 21.34,40.01 23.29,40.01
  Top 7.62: 5.26,50.49 arc-1 20.27,50.49
  pour Top: 22.58,47.83 22.58,51.56 26.31,51.56
  pour Top: 15.82,46.94 19.91,46.94 19.91,42.85
  pour Top: 24,41.96 22.94,43.03 22.94,41.96
  pour Top: 44.45,51.21 46.58,51.21 46.58,48.72 44.09,51.21
  pour Top: 45.52,41.07 46.58,42.14 46.58,41.07
N$14  (via drill 0.35)
  Top 0.152: 44.27,12.85 44.27,13.69 43.43,12.85 39.83,12.85 39.83,14.22 41.2,12.85 41.78,12.85 | 37.29,22.99 37.29,22.1 | 37.29,22.1 37.29,16.54 37.22,16.47 | 37.22,16.47 36.4,15.65 | 37.22,16.47 37.22,13.68 36.4,12.85 | 34.85,8.15 32.18,8.15 | 36.4,8.15 36.4,11.3 | 36.4,22.99 37.29,22.1
  Top 0.254: C3.2 34.64,15.04 C2.2 34.68,15.2 C1.1 35.87,17.84 35.87,16.18 36.4,15.65 | RPG.1 41.25,46.06 v41.25,47.3 41.25,49.07 41.3,49.11 41.3,49.74 40.67,50.37 33.65,50.37 32.46,49.18 32.46,48.07 33.28,47.25 34.01,47.25 RFBT.2 | COUT4.1 COUT2.1 | v47.12,36.45 48.69,34.87 L1.1 45.9,27.25 COUT1.1 45.95,20.85 COUT3.1 45.95,12.95 47.55,11.35 COUT4.1 | 47.55,13.77 47.65,13.87 | COUT4.1 47.55,16.79 47.65,16.89
  Top 1.524: U$2.VCC 27.08,22.99 | U$1.VCC 26.87,8.15
  Top 1.778: 26.87,8.15 32.18,8.15 33.25,8.15 | 33.25,8.15 34.85,8.15 36.4,8.15 | 36.4,22.99 37.29,22.99 | 33.25,8.15 36.4,11.3 36.4,12.85
  Top 1.854: 27.08,22.99 36.4,22.99
  Top 3.81: 36.4,22.99 arc1 36.4,15.65 36.4,12.85 | 36.4,12.85 arc-1 36.4,8.15 | L1.1 arc50 47.65,29 47.65,16.89 47.65,13.87 46.63,12.85 44.27,12.85 41.78,12.85 39.83,12.85 36.4,12.85 | 47.55,13.77 arc-1 COUT4.1
  Bottom 0.254: v41.25,47.3 41.25,44.31 42.09,43.48 42.09,41.48 v47.12,36.45
  pour Top: 34.67,20.62 34.67,22.4 32.72,22.4 34.49,20.62
  pour Top: 38.05,17.42 40.89,14.58 38.05,14.58
  pour Top: 38.05,8.36 40.89,11.2 38.05,11.2
  pour Top: 45.87,15.47 44.98,14.58 45.87,14.58
  pour Top: 38.4,10.31 38.4,8.18 37.52,7.29 35.92,7.29 35.92,10.31
  pour Top: 36.45,23.83 37.69,23.83 38.23,23.29 38.23,22.76 36.45,22.76
V_OUT
  Top 0.152: U$1.SRC5 24.32,9.7 24.25,9.78 24.06,9.78 | U$2.SRC1 24.07,21.36 24.06,21.36 | 23.82,18.49 23.82,13.16 23.82,11.02 | 18.31,13.51 19.56,13.51 | 20.27,8.71 19.56,9.42 19.56,10.49 20.89,11.82 20.89,13.96 | 22.67,12 22.67,12.74 | 22.67,12.74 22.59,12.81 | 22.59,12.81 21.87,13.54 | 20.99,14.41 19.66,15.75 19.66,15.19 20.89,13.96 | 21.16,10.49 20.99,10.65 20.99,13.16 | 20.99,13.16 20.99,14.41 | 21.87,11.2 21.87,13.54 | 21.87,13.54 20.99,14.41 | 23.82,11.02 22.76,12.09 | 22.59,12.25 22.59,12.81 | 20.99,13.16 24.63,9.52 U$1.SRC3 23.82,11.02 | 22.59,12.25 20.89,13.96 | 22.76,12.09 22.76,12.65 22.67,12.74 | 17.78,4.57 18.01,4.8 19.56,4.8 | 22.76,11.2 22.76,12.09 | 22.76,12.09 22.59,12.25
  Top 0.254: U$2.SRC5 | U$2.SRC5 U$2.SRC4 U$2.SRC3 U$2.SRC2 U$2.SRC1 | U$1.SRC5 U$1.SRC4 U$1.SRC3 U$1.SRC2 U$1.SRC1 26.32,10.75 C4.2 | C6.2 27.09,19.09 | 27.09,19.09 26.31,19.86 U$2.SRC5 | C5.2 27.09,15.95 27.09,19.09
  Top 0.381: 24.06,9.78 22.84,8.56 R3.2 | R2.2 23.94,26.2 23.46,25.72 23.46,21.96 24.06,21.36
  Top 1.27: 17.07,14.81 18.8,16.54 19.02,16.54 17.3,14.81 17.07,14.81 | 17.07,14.81 17.07,14.76 18.31,13.51 | 19.66,22.66 17.25,25.07
  Top 1.524: 15.34,25.07 GND_OUT3.2 | 18.72,14.81 19.56,15.65
  Top 1.778: 19.66,25.07 17.25,25.07 15.34,25.07 | GND_OUT2.2 17.07,14.81 18.72,14.81 | GND_OUT1.2 17.07,4.57 17.78,4.57 | 21.43,20.89 19.66,22.66 20.46,22.66 22.23,20.89 | 21.43,20.89 23.82,18.49 | 23.82,13.16 22.67,12 21.87,11.2 | 19.66,22.94 22.33,20.27 23.82,20.27 23.2,20.89 22.23,20.89 | 21.87,11.2 21.16,10.49 19.56,8.89 | 21.87,11.2 22.76,11.2 20.27,8.71 | 22.23,20.89 21.43,20.89
  Top 3.81: U$2.SRC3 arc-1 U$1.SRC3 | 19.66,22.66 19.66,15.75 19.56,15.65 19.56,13.51 19.56,10.49 19.56,8.89 19.56,4.8 | 19.66,25.07 19.66,22.94
  Top 7.62: C5.2 arc1 19.66,15.75
  pour Top: 16.71,5.33 17.78,6.4 17.78,5.33
  pour Top: 23.65,9.78 22.4,9.78 22.4,10.85 23.65,10.85
  pour Top: 23.65,9.42 22.05,9.42 22.05,9.78 23.65,9.78
  pour Top: 23.47,21.87 22.4,21.87 22.4,21.69 23.47,21.69

### Text on the board
tPlace: QSET - 2019/20 | 12/9V to 5V Converter and E-Fuse | OUT_1 | WARNING: Might be hot when active | GND | V+ | OUT_2 | GND | V+ | OUT_3 | GND | EN/FLT | V+ | Sci '21
bPlace: LS | EP